# EAGLE schematic connectors (EAGLE 7.2.0)
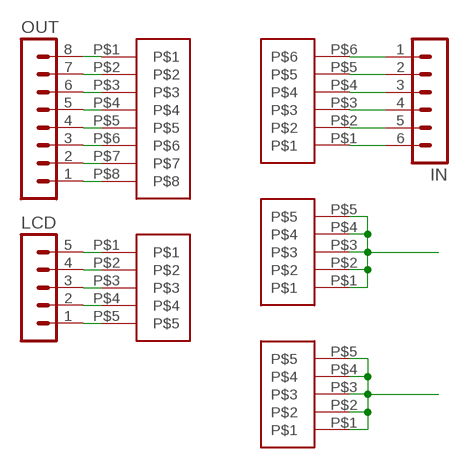
[diagram p0: schematic, sheet 1]

## Parts
IN  MA06-1  [MA06-1]
LCD  MA05-1  [MA05-1]
OUT  MA08-1  [MA08-1]
U$1  KOSTKA_2.5MM_X8  [X8]
U$2  KOSTKA_2.5MM_X5  [X5]
U$3  KOSTKA_2.5MM_X6  [X6]
U$4  KOSTKA_2.5MM_X5  [X5]
U$6  KOSTKA_2.5MM_X5  [X5]

## Nets
GND: U$4.P$1 U$4.P$2 U$4.P$3 U$4.P$4 U$4.P$5
N$1: OUT.8 U$1.P$1
N$3: OUT.7 U$1.P$2
N$4: OUT.6 U$1.P$3
N$5: OUT.5 U$1.P$4
N$6: OUT.4 U$1.P$5
N$7: OUT.3 U$1.P$6
N$8: OUT.2 U$1.P$7
N$9: OUT.1 U$1.P$8
N$17: LCD.1 U$6.P$5
N$24: IN.1 U$3.P$6
N$25: IN.2 U$3.P$5
N$26: IN.3 U$3.P$4
N$27: IN.4 U$3.P$3
N$28: IN.5 U$3.P$2
N$29: IN.6 U$3.P$1
N$36: LCD.2 U$6.P$4
N$37: LCD.3 U$6.P$3
N$38: LCD.4 U$6.P$2
N$39: LCD.5 U$6.P$1
VCC: U$2.P$1 U$2.P$2 U$2.P$3 U$2.P$4 U$2.P$5

## Library data of the parts
IN = con-lstb:MA06-1: PIN HEADER; OC_FARNELL: unknown; OC_NEWARK: unknown
LCD = con-lstb:MA05-1: PIN HEADER; OC_FARNELL: unknown; OC_NEWARK: unknown
OUT = con-lstb:MA08-1: PIN HEADER; OC_FARNELL: unknown; OC_NEWARK: unknown
U$1 = kostka:KOSTKA_2.5MM_X8
U$2 U$4 U$6 = kostka:KOSTKA_2.5MM_X5
U$3 = kostka:KOSTKA_2.5MM_X6